# EAGLE schematic atmega2560.2 (EAGLE 8.3.0)

## Sheet 1 of 7
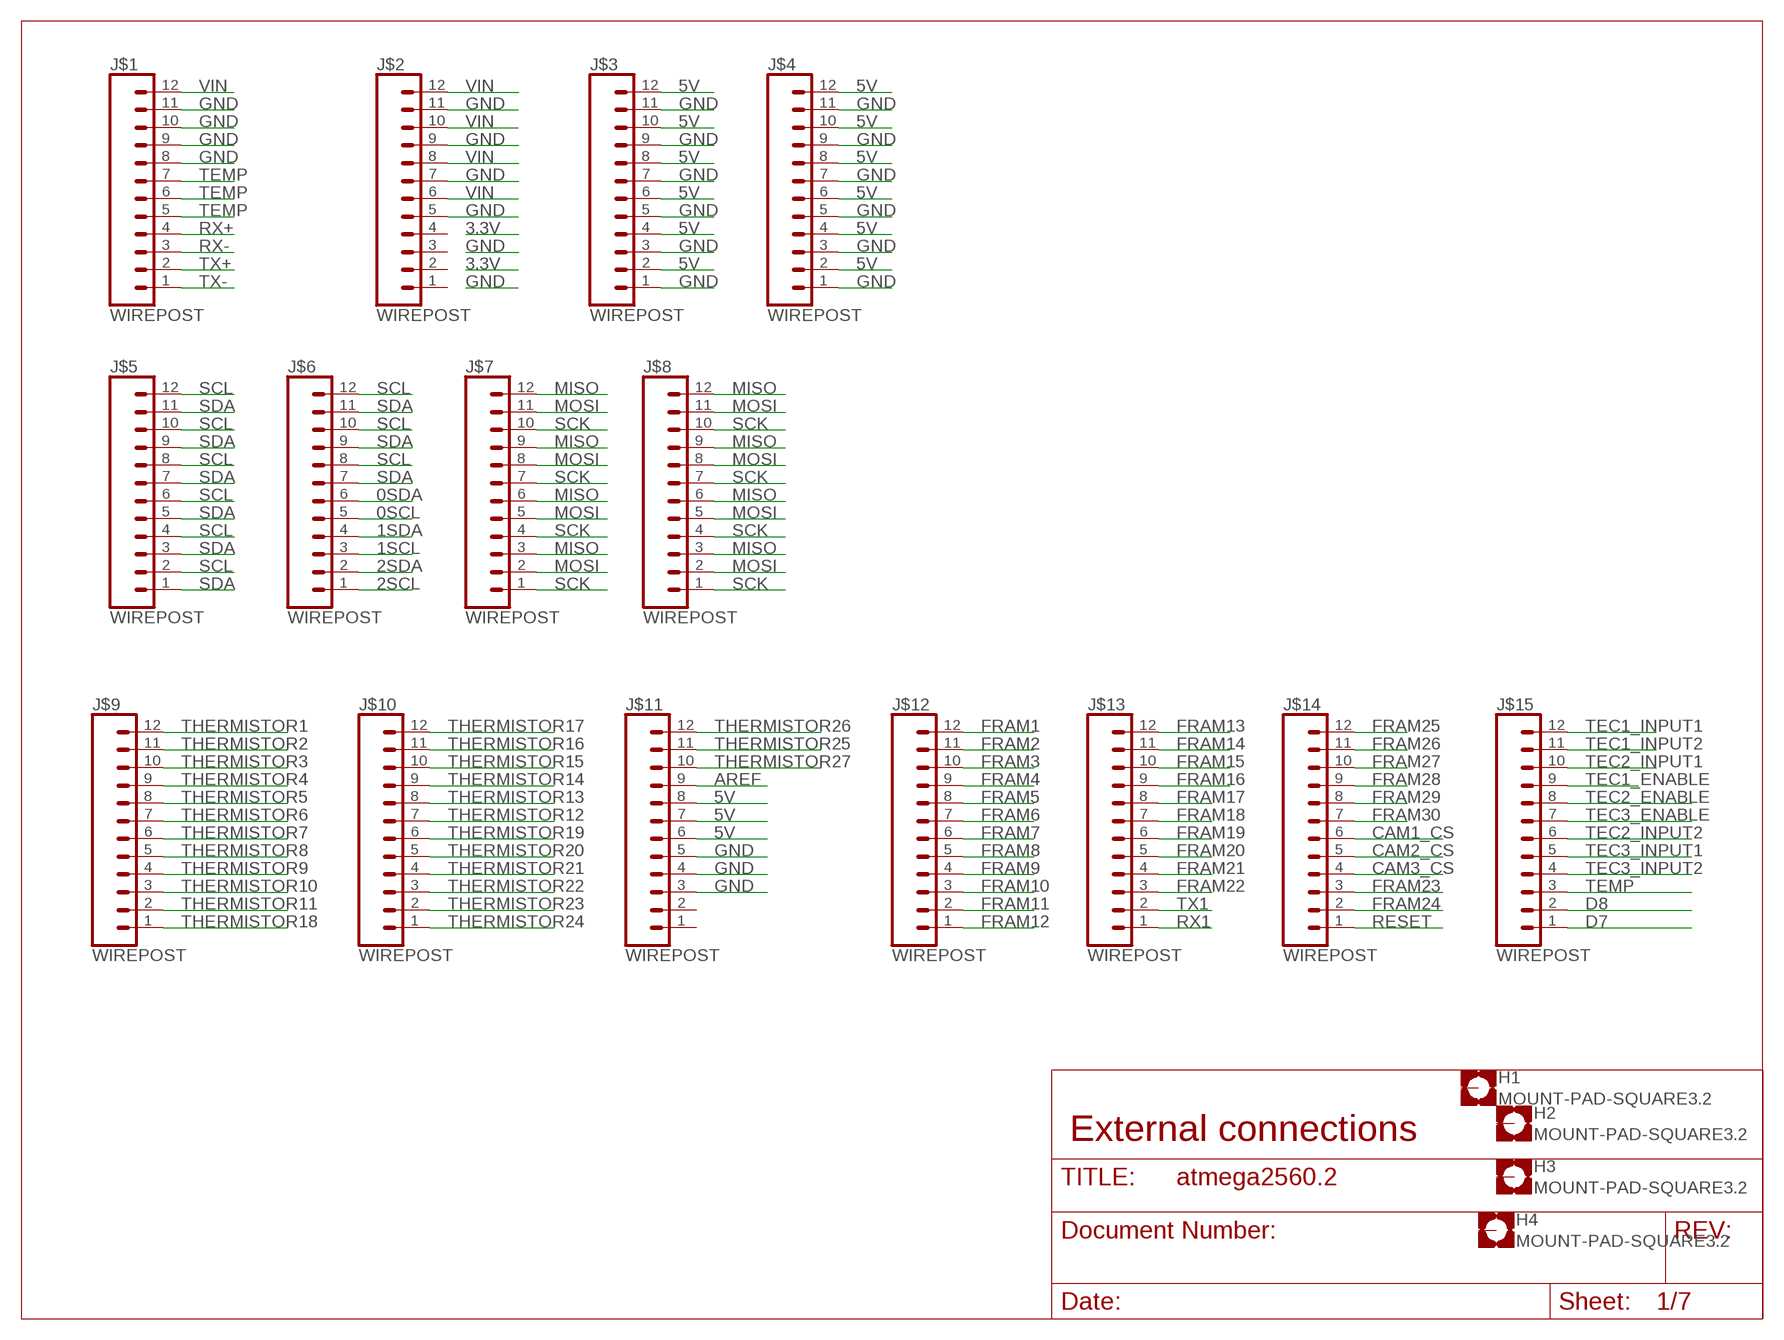
[diagram p0: schematic, sheet 1]

### Parts
H1  MOUNT-PAD-SQUARE3.2  [3,2-PAD-SQUARE]
H2  MOUNT-PAD-SQUARE3.2  [3,2-PAD-SQUARE]
H3  MOUNT-PAD-SQUARE3.2  [3,2-PAD-SQUARE]
H4  MOUNT-PAD-SQUARE3.2  [3,2-PAD-SQUARE]
J$1  WIREPOST  [WIREWRAPPOST]
J$2  WIREPOST  [WIREWRAPPOST]
J$3  WIREPOST  [WIREWRAPPOST]
J$4  WIREPOST  [WIREWRAPPOST]
J$5  WIREPOST  [WIREWRAPPOST]
J$6  WIREPOST  [WIREWRAPPOST]
J$7  WIREPOST  [WIREWRAPPOST]
J$8  WIREPOST  [WIREWRAPPOST]
J$9  WIREPOST  [WIREWRAPPOST]
J$10  WIREPOST  [WIREWRAPPOST]
J$11  WIREPOST  [WIREWRAPPOST]
J$12  WIREPOST  [WIREWRAPPOST]
J$13  WIREPOST  [WIREWRAPPOST]
J$14  WIREPOST  [WIREWRAPPOST]
J$15  WIREPOST  [WIREWRAPPOST]

### Nets
0SCL: J$6.5 ; also sheet 7
0SDA: J$6.6 ; also sheet 7
1SCL: J$6.3 ; also sheet 7
1SDA: J$6.4 ; also sheet 7
2SCL: J$6.1 ; also sheet 7
2SDA: J$6.2 ; also sheet 7
5V: J$3.2 J$3.4 J$3.6 J$3.8 J$3.10 J$3.12 J$4.2 J$4.4 J$4.6 J$4.8 J$4.10 J$4.12 J$11.6 J$11.7 J$11.8 ; also sheet 2,3,4,5,6,7
AREF: J$11.9 ; also sheet 4
CAM1_CS: J$14.6 ; also sheet 4
CAM2_CS: J$14.5 ; also sheet 4
CAM3_CS: J$14.4 ; also sheet 4
D7: J$15.1 ; also sheet 4
D8: J$15.2 ; also sheet 4
FRAM1: J$12.12 ; also sheet 4
FRAM2: J$12.11 ; also sheet 4
FRAM3: J$12.10 ; also sheet 4
FRAM4: J$12.9 ; also sheet 4
FRAM5: J$12.8 ; also sheet 4
FRAM6: J$12.7 ; also sheet 4
FRAM7: J$12.6 ; also sheet 4
FRAM8: J$12.5 ; also sheet 4
FRAM9: J$12.4 ; also sheet 4
FRAM10: J$12.3 ; also sheet 4
FRAM11: J$12.2 ; also sheet 4
FRAM12: J$12.1 ; also sheet 4
FRAM13: J$13.12 ; also sheet 4
FRAM14: J$13.11 ; also sheet 4
FRAM15: J$13.10 ; also sheet 4
FRAM16: J$13.9 ; also sheet 4
FRAM17: J$13.8 ; also sheet 4
FRAM18: J$13.7 ; also sheet 4
FRAM19: J$13.6 ; also sheet 4
FRAM20: J$13.5 ; also sheet 4
FRAM21: J$13.4 ; also sheet 4
FRAM22: J$13.3 ; also sheet 4
FRAM23: J$14.3 ; also sheet 4
FRAM24: J$14.2 ; also sheet 4
FRAM25: J$14.12 ; also sheet 4
FRAM26: J$14.11 ; also sheet 4
FRAM27: J$14.10 ; also sheet 4
FRAM28: J$14.9 ; also sheet 4
FRAM29 [power usb]: J$14.8 ; also sheet 4
FRAM30: J$14.7 ; also sheet 4
GND [gnd]: J$1.8 J$1.9 J$1.10 J$1.11 J$2.5 J$2.7 J$2.9 J$2.11 J$3.1 J$3.3 J$3.5 J$3.7 J$3.9 J$3.11 J$4.1 J$4.3 J$4.5 J$4.7 J$4.9 J$4.11 J$11.3 J$11.4 J$11.5 ; also sheet 2,3,4,5,6,7
MISO: J$7.3 J$7.6 J$7.9 J$7.12 J$8.3 J$8.6 J$8.9 J$8.12 ; also sheet 4
MOSI: J$7.2 J$7.5 J$7.8 J$7.11 J$8.2 J$8.5 J$8.8 J$8.11 ; also sheet 4
RESET: J$14.1 ; also sheet 4,5
RX1: J$13.1 ; also sheet 4
RX+: J$1.4 ; also sheet 3
RX-: J$1.3 ; also sheet 3
SCK: J$7.1 J$7.4 J$7.7 J$7.10 J$8.1 J$8.4 J$8.7 J$8.10 ; also sheet 4
SCL: J$5.2 J$5.4 J$5.6 J$5.8 J$5.10 J$5.12 J$6.8 J$6.10 J$6.12 ; also sheet 4,7
SDA: J$5.1 J$5.3 J$5.5 J$5.7 J$5.9 J$5.11 J$6.7 J$6.9 J$6.11 ; also sheet 4,7
TEC1_ENABLE: J$15.9 ; also sheet 4
TEC1_INPUT1: J$15.12 ; also sheet 4
TEC1_INPUT2: J$15.11 ; also sheet 4
TEC2_ENABLE: J$15.8 ; also sheet 4
TEC2_INPUT1: J$15.10 ; also sheet 4
TEC2_INPUT2: J$15.6 ; also sheet 4
TEC3_ENABLE: J$15.7 ; also sheet 4
TEC3_INPUT1: J$15.5 ; also sheet 4
TEC3_INPUT2: J$15.4 ; also sheet 4
TEMP: J$1.5 J$1.6 J$1.7 J$15.3 ; also sheet 2,4
THERMISTOR1: J$9.12 ; also sheet 4
THERMISTOR2: J$9.11 ; also sheet 4
THERMISTOR3: J$9.10 ; also sheet 4
THERMISTOR4: J$9.9 ; also sheet 4
THERMISTOR5: J$9.8 ; also sheet 4
THERMISTOR6: J$9.7 ; also sheet 4
THERMISTOR7: J$9.6 ; also sheet 4
THERMISTOR8: J$9.5 ; also sheet 4
THERMISTOR9: J$9.4 ; also sheet 4
THERMISTOR10: J$9.3 ; also sheet 4
THERMISTOR11: J$9.2 ; also sheet 4
THERMISTOR12: J$10.7 ; also sheet 6
THERMISTOR13: J$10.8 ; also sheet 6
THERMISTOR14: J$10.9 ; also sheet 6
THERMISTOR15: J$10.10 ; also sheet 6
THERMISTOR16: J$10.11 ; also sheet 6
THERMISTOR17: J$10.12 ; also sheet 6
THERMISTOR18: J$9.1 ; also sheet 6
THERMISTOR19: J$10.6 ; also sheet 6
THERMISTOR20: J$10.5 ; also sheet 6
THERMISTOR21: J$10.4 ; also sheet 6
THERMISTOR22: J$10.3 ; also sheet 6
THERMISTOR23: J$10.2 ; also sheet 6
THERMISTOR24: J$10.1 ; also sheet 6
THERMISTOR25: J$11.11 ; also sheet 6
THERMISTOR26: J$11.12 ; also sheet 6
THERMISTOR27: J$11.10 ; also sheet 6
TX1: J$13.2 ; also sheet 4
TX+: J$1.2 ; also sheet 3
TX- [power]: J$1.1 ; also sheet 3
VIN [power]: J$1.12 J$2.6 J$2.8 J$2.10 J$2.12 ; also sheet 2
Unconnected: H1.B3,2(MOUNT) H2.B3,2(MOUNT) H3.B3,2(MOUNT) H4.B3,2(MOUNT) J$2.1 J$2.2 J$2.3 J$2.4 J$11.1 J$11.2

### Notes on the sheet
- External connections

## Sheet 2 of 7
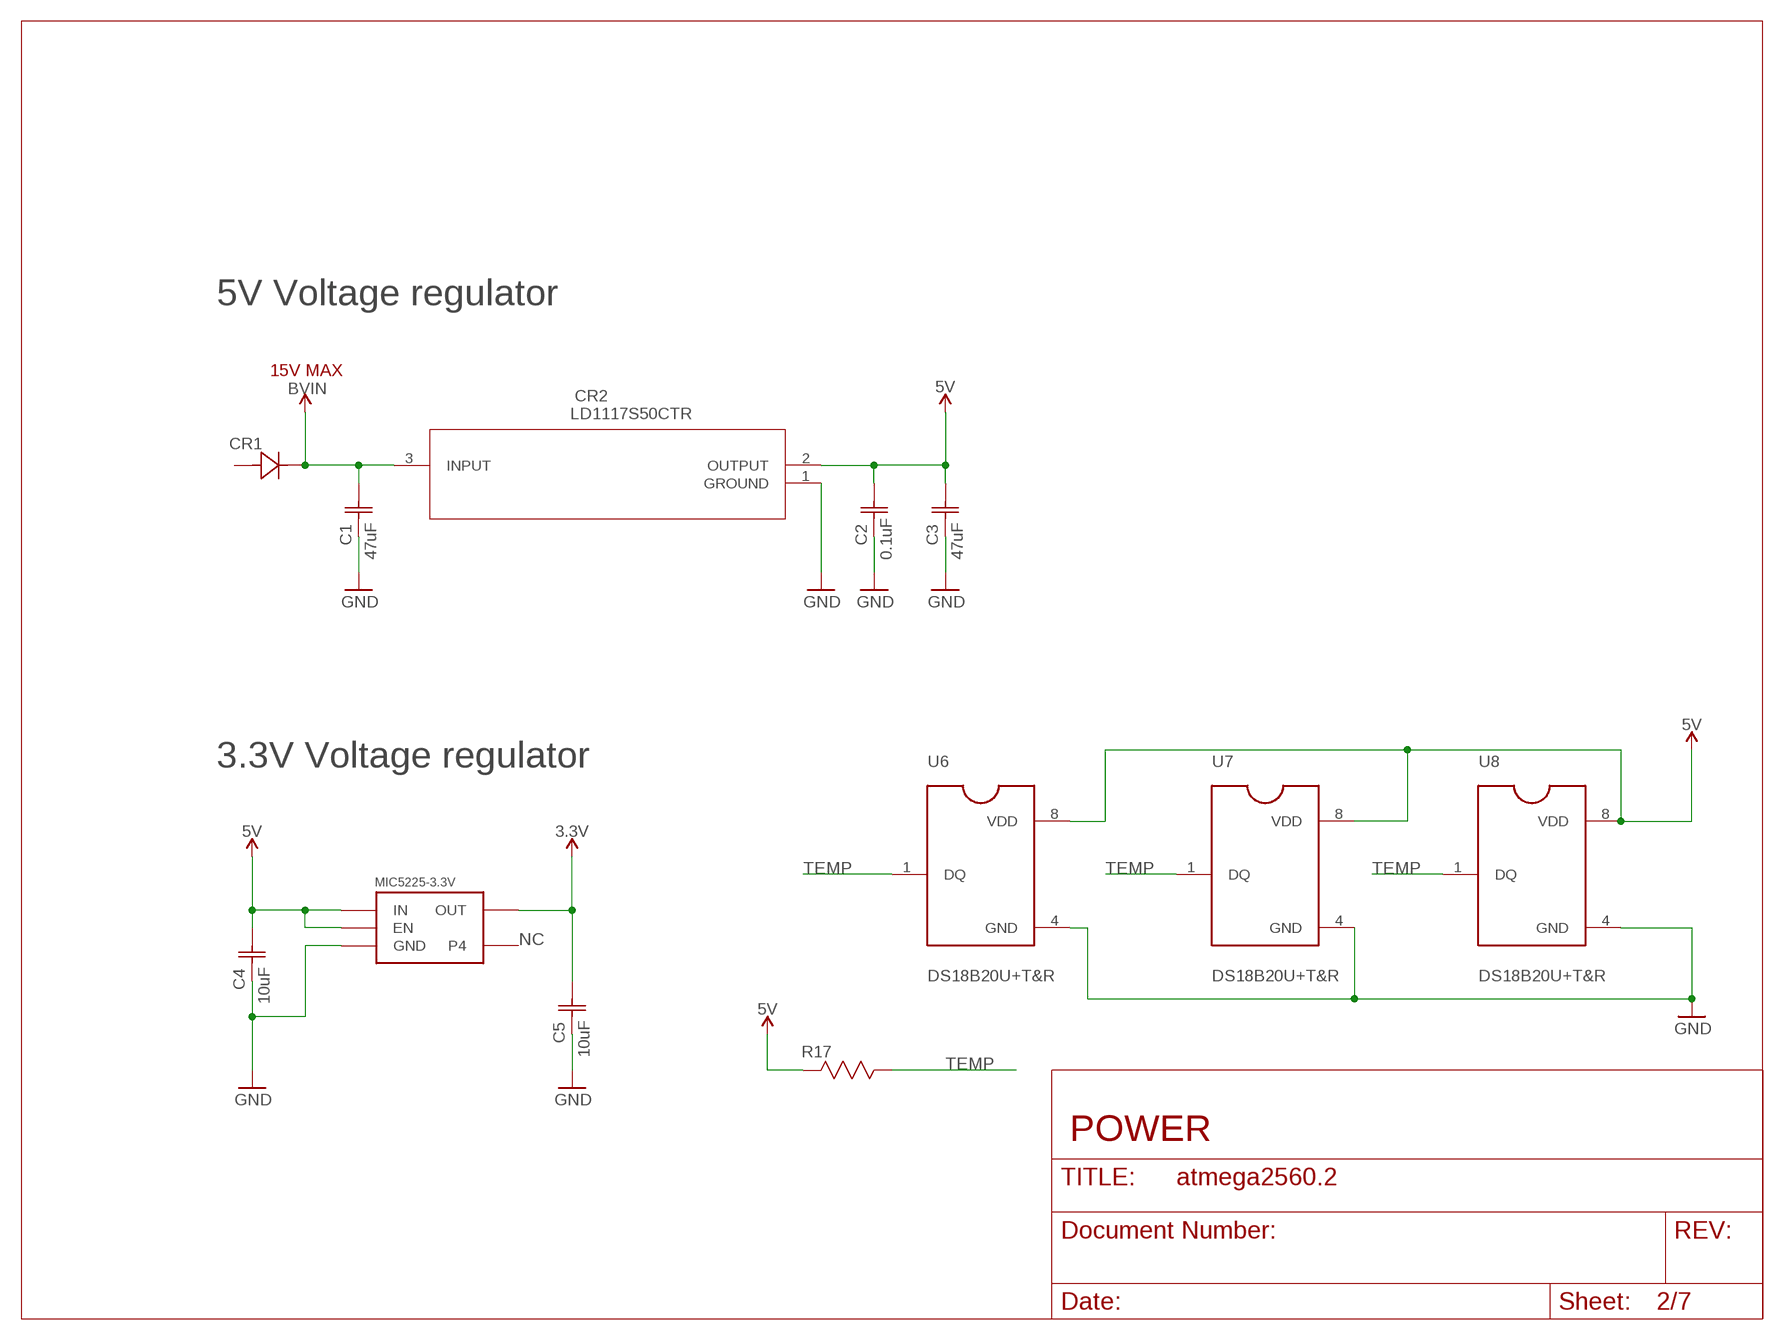
[diagram p1: schematic, sheet 2]

### Parts
C1  47uF  CAP_47UF  [CAP_5750]
C2  0.1uF  CAP_01UF  [CAP_01]
C3  47uF  CAP_47UF  [CAP_5750]
C4  10uF  CAP_10UF  [CAP_GRM219R61A106KE44D]
C5  10uF  CAP_10UF  [CAP_GRM219R61A106KE44D]
CR1  DIODE_600V_3A  [DIODE_600V_3A]
CR2  LD1117S50CTR  [SOT-223]
R17  RES_4_7K  [RC0603N]
U1  MIC5225  [SOT23-5]
U6  DS18B20U+T&R  [SOP65P500X110-8N]
U7  DS18B20U+T&R  [SOP65P500X110-8N]
U8  DS18B20U+T&R  [SOP65P500X110-8N]

### Nets
3.3V: C5.2 U1.OUT ; supply symbol labelled POWER_3.3V ; also sheet 1,3
5V: C2.2 C3.2 C4.2 CR2.2(OUTPUT) R17.2 U1.EN U1.IN U6.8(VDD) U7.8(VDD) U8.8(VDD) ; supply symbol labelled POWER_5V ; also sheet 1,3,4,5,6,7
GND [gnd]: C1.1 C2.1 C3.1 C4.1 C5.1 CR2.1(GROUND) U1.GND U6.4(GND) U7.4(GND) U8.4(GND) ; supply symbol labelled POWER_GND ; also sheet 1,3,4,5,6,7
TEMP: R17.1 U6.1(DQ) U7.1(DQ) U8.1(DQ) ; also sheet 1,4
VIN [power]: C1.2 CR1.1 CR2.3(INPUT) ; supply symbol labelled POWER_VIN ; also sheet 1
Unconnected: CR1.2 U1.NC/ADJ(P4)

### Notes on the sheet
- 5V Voltage regulator
- 15V MAX
- 3.3V Voltage regulator
- NC
- POWER

## Sheet 3 of 7
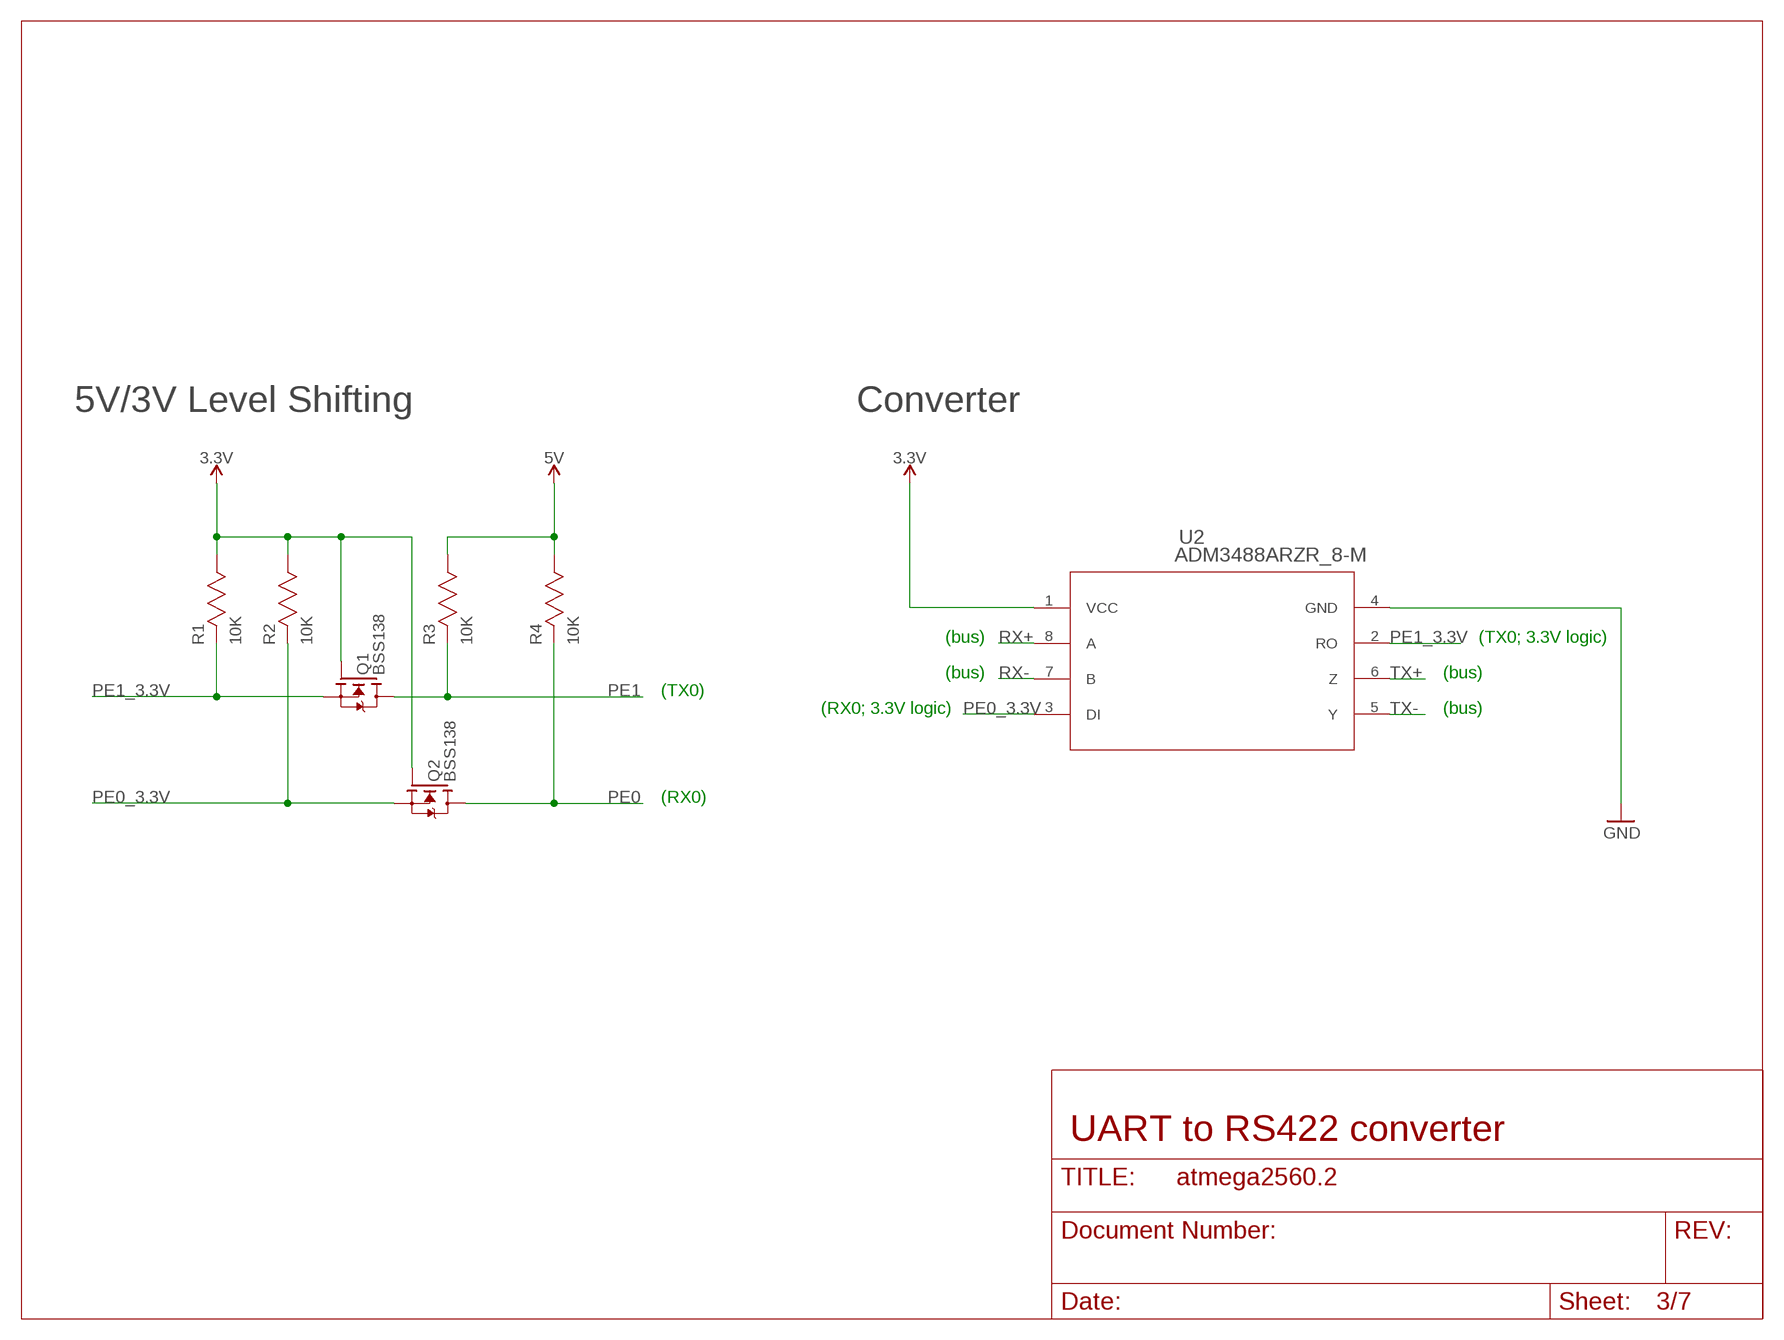
[diagram p2: schematic, sheet 3]

### Parts
Q1  BSS138  [SOT-23]
Q2  BSS138  [SOT-23]
R1  10K  RES_10K  [RC0603N]
R2  10K  RES_10K  [RC0603N]
R3  10K  RES_10K  [RC0603N]
R4  10K  RES_10K  [RC0603N]
U2  ADM3488ARZR_8-M  [R_8-M]

### Nets
3.3V: Q1.G Q2.G R1.1 R2.1 U2.1(VCC) ; supply symbol labelled POWER_3.3V ; also sheet 1,2
5V: R3.1 R4.1 ; supply symbol labelled POWER_5V ; also sheet 1,2,4,5,6,7
GND [gnd]: U2.4(GND) ; supply symbol labelled POWER_GND ; also sheet 1,2,4,5,6,7
PE0: Q2.D R4.2 ; also sheet 4,5
PE0_3.3V: Q2.S R2.2 U2.3(DI)
PE1: Q1.D R3.2 ; also sheet 4,5
PE1_3.3V: Q1.S R1.2 U2.2(RO)
RX+: U2.8(A) ; also sheet 1
RX-: U2.7(B) ; also sheet 1
TX+: U2.6(Z) ; also sheet 1
TX- [power]: U2.5(Y) ; also sheet 1

### Notes on the sheet
- 5V/3V Level Shifting | Converter
- (bus) | (TX0; 3.3V logic)
- (bus) | (bus)
- (TX0)
- (RX0; 3.3V logic) | (bus)
- (RX0)
- UART to RS422 converter

## Sheet 4 of 7
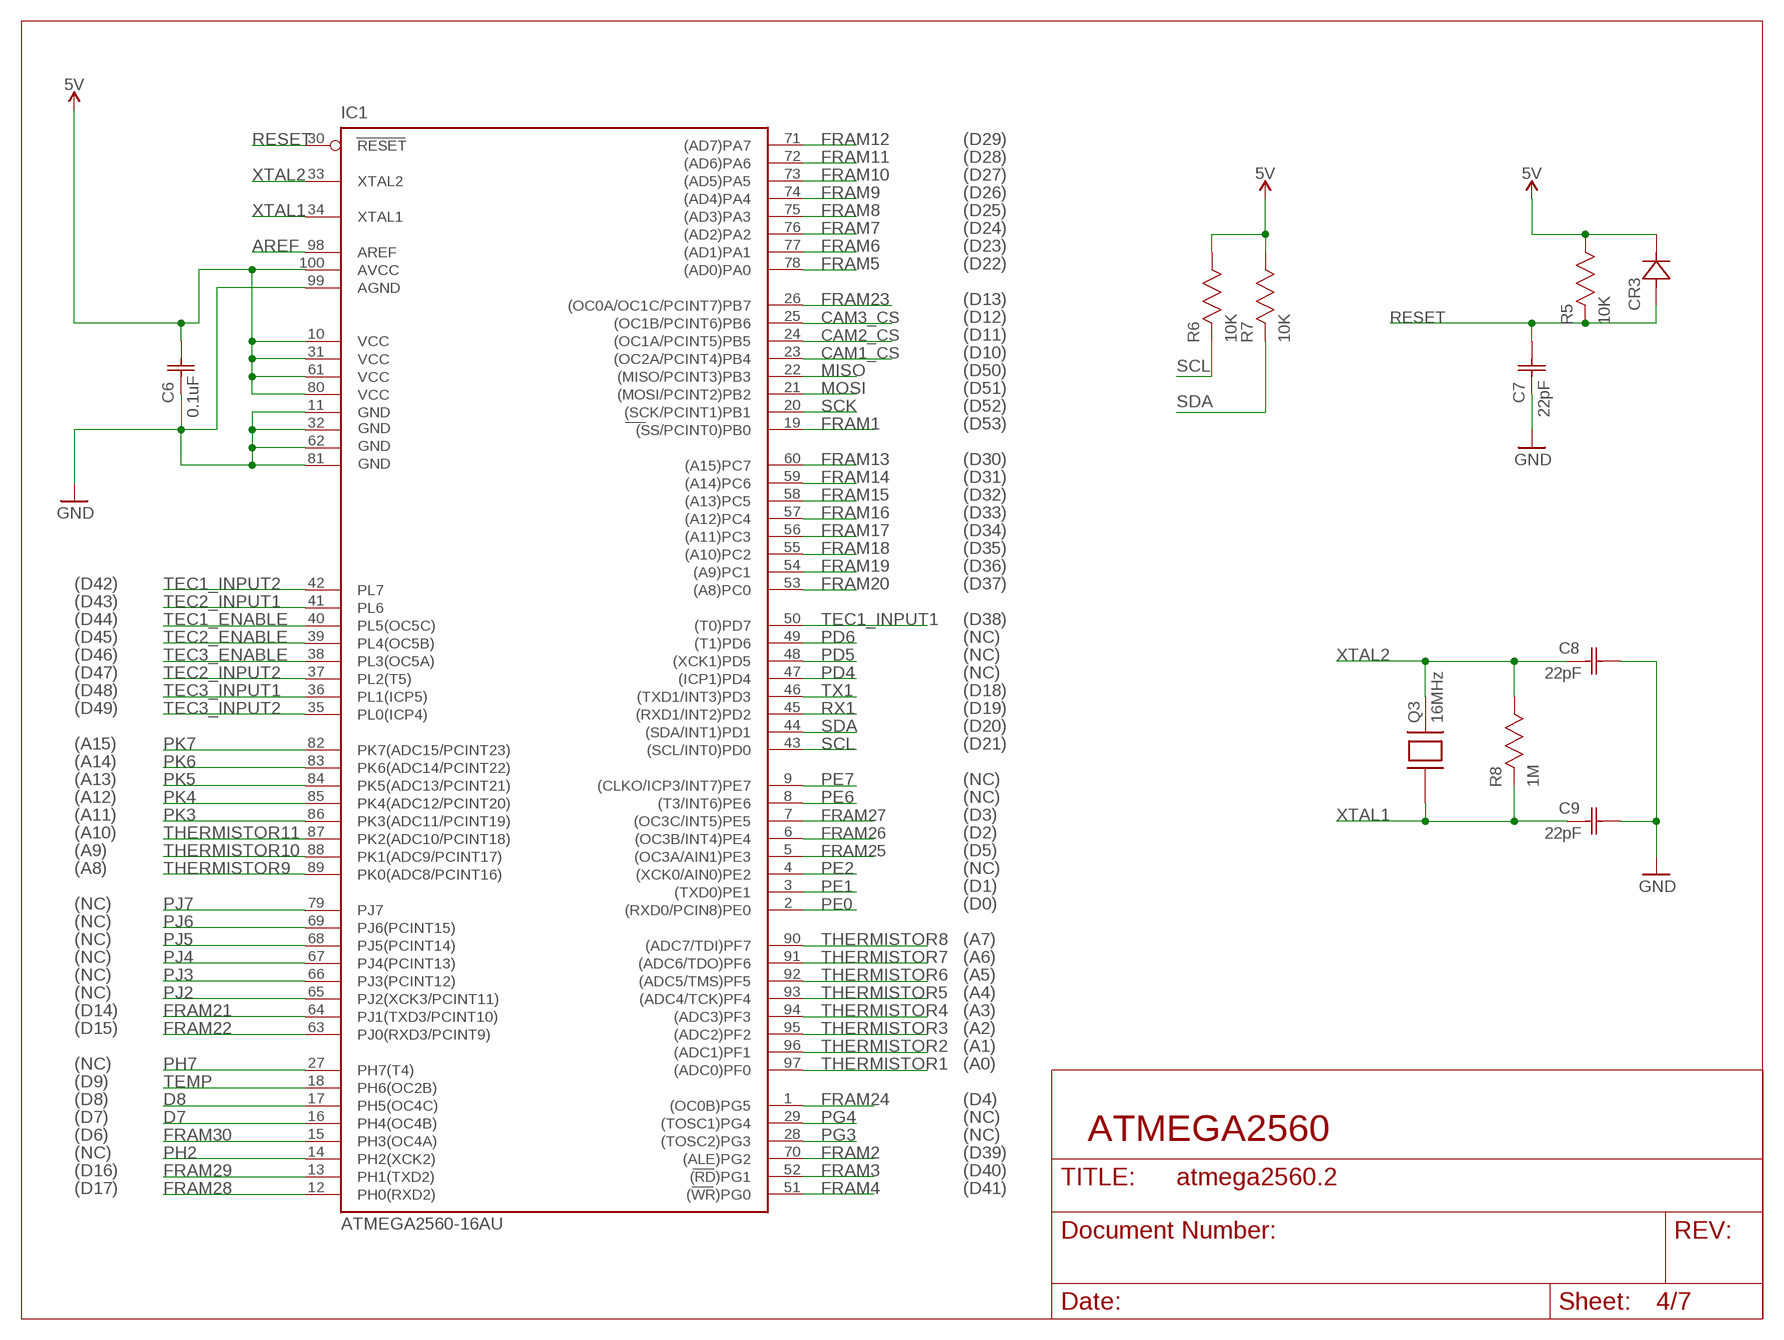
[diagram p3: schematic, sheet 4]

### Parts
C6  0.1uF  CAP_01UF  [CAP_01]
C7  22pF  CAP_22PF  [CC0805N]
C8  22pF  CAP_22PF  [CC0805N]
C9  22pF  CAP_22PF  [CC0805N]
CR3  DIODE_600V_3A  [DIODE_600V_3A]
IC1  ATMEGA2560-16AU  ATMEGA25602560-16AU  [TQFP100]
Q3  16MHz  OSILLATOR  [OSCILLATOR]
R5  10K  RES_10K  [RC0603N]
R6  10K  RES_10K  [RC0603N]
R7  10K  RES_10K  [RC0603N]
R8  1M  RES_1M  [RC0603N]

### Nets
5V: C6.2 CR3.1 IC1.10(VCC) IC1.31(VCC1) IC1.61(VCC2) IC1.80(VCC3) IC1.100(AVCC) R5.1 R6.1 R7.1 ; supply symbol labelled POWER_5V ; also sheet 1,2,3,5,6,7
AREF: IC1.98(AREF) ; also sheet 1
CAM1_CS: IC1.23((OC2A/PCINT4)PB4) ; also sheet 1
CAM2_CS: IC1.24((OC1A/PCINT5)PB5) ; also sheet 1
CAM3_CS: IC1.25((OC1B/PCINT6)PB6) ; also sheet 1
D7: IC1.16(PH4(OC4B)) ; also sheet 1
D8: IC1.17(PH5(OC4C)) ; also sheet 1
FRAM1: IC1.19((SS/PCINT0)PB0) ; also sheet 1
FRAM2: IC1.70((ALE)PG2) ; also sheet 1
FRAM3: IC1.52((RD)PG1) ; also sheet 1
FRAM4: IC1.51((WR)PG0) ; also sheet 1
FRAM5: IC1.78((AD0)PA0) ; also sheet 1
FRAM6: IC1.77((AD1)PA1) ; also sheet 1
FRAM7: IC1.76((AD2)PA2) ; also sheet 1
FRAM8: IC1.75((AD3)PA3) ; also sheet 1
FRAM9: IC1.74((AD4)PA4) ; also sheet 1
FRAM10: IC1.73((AD5)PA5) ; also sheet 1
FRAM11: IC1.72((AD6)PA6) ; also sheet 1
FRAM12: IC1.71((AD7)PA7) ; also sheet 1
FRAM13: IC1.60((A15)PC7) ; also sheet 1
FRAM14: IC1.59((A14)PC6) ; also sheet 1
FRAM15: IC1.58((A13)PC5) ; also sheet 1
FRAM16: IC1.57((A12)PC4) ; also sheet 1
FRAM17: IC1.56((A11)PC3) ; also sheet 1
FRAM18: IC1.55((A10)PC2) ; also sheet 1
FRAM19: IC1.54((A9)PC1) ; also sheet 1
FRAM20: IC1.53((A8)PC0) ; also sheet 1
FRAM21: IC1.64(PJ1(TXD3/PCINT10)) ; also sheet 1
FRAM22: IC1.63(PJ0(RXD3/PCINT9)) ; also sheet 1
FRAM23: IC1.26((OC0A/OC1C/PCINT7)PB7) ; also sheet 1
FRAM24: IC1.1((OC0B)PG5) ; also sheet 1
FRAM25: IC1.5((OC3A/AIN1)PE3) ; also sheet 1
FRAM26: IC1.6((OC3B/INT4)PE4) ; also sheet 1
FRAM27: IC1.7((OC3C/INT5)PE5) ; also sheet 1
FRAM28: IC1.12(PH0(RXD2)) ; also sheet 1
FRAM29 [power usb]: IC1.13(PH1(TXD2)) ; also sheet 1
FRAM30: IC1.15(PH3(OC4A)) ; also sheet 1
GND [gnd]: C6.1 C7.1 C8.2 C9.2 IC1.11(GND) IC1.32(GND1) IC1.62(GND2) IC1.81(GND3) IC1.99(AGND) ; supply symbol labelled POWER_GND ; also sheet 1,2,3,5,6,7
MISO: IC1.22((MISO/PCINT3)PB3) ; also sheet 1
MOSI: IC1.21((MOSI/PCINT2)PB2) ; also sheet 1
PD4: IC1.47((ICP1)PD4)
PD5: IC1.48((XCK1)PD5)
PD6: IC1.49((T1)PD6)
PE0: IC1.2((RXD0/PCIN8)PE0) ; also sheet 3,5
PE1: IC1.3((TXD0)PE1) ; also sheet 3,5
PE2: IC1.4((XCK0/AIN0)PE2)
PE6: IC1.8((T3/INT6)PE6)
PE7: IC1.9((CLKO/ICP3/INT7)PE7)
PG3: IC1.28((TOSC2)PG3)
PG4: IC1.29((TOSC1)PG4)
PH2: IC1.14(PH2(XCK2))
PH7: IC1.27(PH7(T4))
PJ2: IC1.65(PJ2(XCK3/PCINT11))
PJ3: IC1.66(PJ3(PCINT12))
PJ4: IC1.67(PJ4(PCINT13))
PJ5: IC1.68(PJ5(PCINT14))
PJ6: IC1.69(PJ6(PCINT15))
PJ7: IC1.79(PJ7)
PK3: IC1.86(PK3(ADC11/PCINT19)) ; also sheet 6
PK4: IC1.85(PK4(ADC12/PCINT20)) ; also sheet 6
PK5: IC1.84(PK5(ADC13/PCINT21)) ; also sheet 6
PK6: IC1.83(PK6(ADC14/PCINT22)) ; also sheet 6
PK7: IC1.82(PK7(ADC15/PCINT23)) ; also sheet 6
RESET: C7.2 CR3.2 IC1.30(RESET) R5.2 ; also sheet 1,5
RX1: IC1.45((RXD1/INT2)PD2) ; also sheet 1
SCK: IC1.20((SCK/PCINT1)PB1) ; also sheet 1
SCL: IC1.43((SCL/INT0)PD0) R6.2 ; also sheet 1,7
SDA: IC1.44((SDA/INT1)PD1) R7.2 ; also sheet 1,7
TEC1_ENABLE: IC1.40(PL5(OC5C)) ; also sheet 1
TEC1_INPUT1: IC1.50((T0)PD7) ; also sheet 1
TEC1_INPUT2: IC1.42(PL7) ; also sheet 1
TEC2_ENABLE: IC1.39(PL4(OC5B)) ; also sheet 1
TEC2_INPUT1: IC1.41(PL6) ; also sheet 1
TEC2_INPUT2: IC1.37(PL2(T5)) ; also sheet 1
TEC3_ENABLE: IC1.38(PL3(OC5A)) ; also sheet 1
TEC3_INPUT1: IC1.36(PL1(ICP5)) ; also sheet 1
TEC3_INPUT2: IC1.35(PL0(ICP4)) ; also sheet 1
TEMP: IC1.18(PH6(OC2B)) ; also sheet 1,2
THERMISTOR1: IC1.97((ADC0)PF0) ; also sheet 1
THERMISTOR2: IC1.96((ADC1)PF1) ; also sheet 1
THERMISTOR3: IC1.95((ADC2)PF2) ; also sheet 1
THERMISTOR4: IC1.94((ADC3)PF3) ; also sheet 1
THERMISTOR5: IC1.93((ADC4/TCK)PF4) ; also sheet 1
THERMISTOR6: IC1.92((ADC5/TMS)PF5) ; also sheet 1
THERMISTOR7: IC1.91((ADC6/TDO)PF6) ; also sheet 1
THERMISTOR8: IC1.90((ADC7/TDI)PF7) ; also sheet 1
THERMISTOR9: IC1.89(PK0(ADC8/PCINT16)) ; also sheet 1
THERMISTOR10: IC1.88(PK1(ADC9/PCINT17)) ; also sheet 1
THERMISTOR11: IC1.87(PK2(ADC10/PCINT18)) ; also sheet 1
TX1: IC1.46((TXD1/INT3)PD3) ; also sheet 1
XTAL1: C9.1 IC1.34(XTAL1) Q3.1 R8.2
XTAL2: C8.1 IC1.33(XTAL2) Q3.2 R8.1

### Notes on the sheet
- (D29)
- (D28)
- (D27)
- (D26)
- (D25)
- (D24)
- (D23)
- (D22)
- (D13)
- (D12)
- (D11)
- (D10)
- (D50)
- (D51)
- (D52)
- (D53)
- (D30)
- (D31)
- (D32)
- (D33)
- (D34)
- (D35)
- (D36)
- (D42) | (D37)
- (D43)
- (D44) | (D38)
- (D45) | (NC)
- (D46) | (NC)
- (D47) | (NC)
- (D48) | (D18)
- (D49) | (D19)
- (D20)
- (A15) | (D21)
- (A14)
- (A13) | (NC)
- (A12) | (NC)
- (A11) | (D3)
- (A10) | (D2)
- (A9) | (D5)
- (A8) | (NC)
- (D1)
- (NC) | (D0)
- (NC)
- (NC) | (A7)
- (NC) | (A6)
- (NC) | (A5)
- (NC) | (A4)
- (D14) | (A3)
- (D15) | (A2)
- (A1)
- (NC) | (A0)
- (D9)
- (D8) | (D4)
- (D7) | (NC)
- (D6) | (NC) | ATMEGA2560
- (NC) | (D39)
- (D16) | (D40)
- (D17) | (D41)

## Sheet 5 of 7
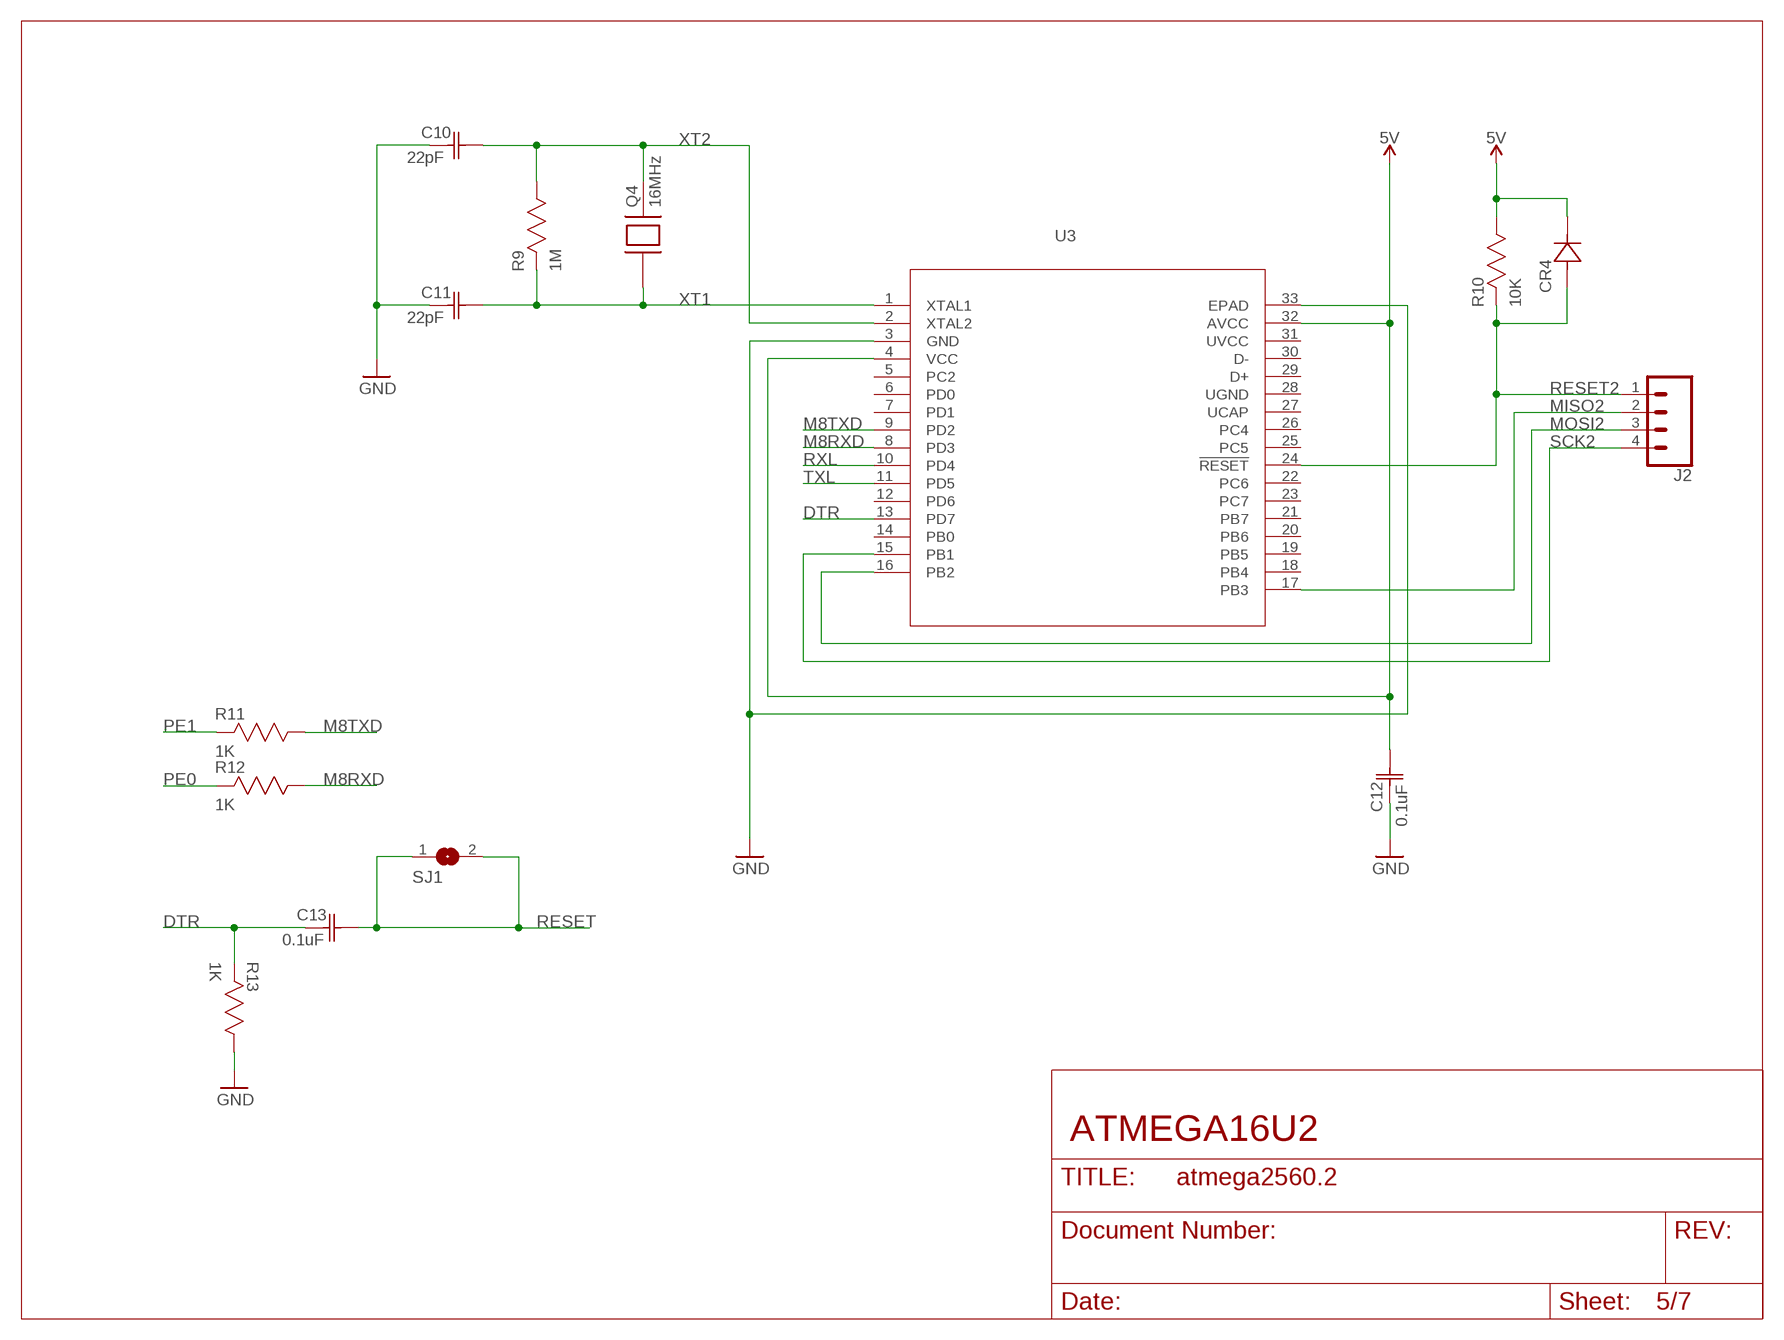
[diagram p4: schematic, sheet 5]

### Parts
C10  22pF  CAP_22PF  [CC0805N]
C11  22pF  CAP_22PF  [CC0805N]
C12  0.1uF  CAP_01UF  [CAP_01]
C13  0.1uF  CAP_01UF  [CAP_01]
CR4  DIODE_600V_3A  [DIODE_600V_3A]
J2  CONN_04  [1X04]
Q4  16MHz  OSILLATOR  [OSCILLATOR]
R9  1M  RES_1M  [RC0603N]
R10  10K  RES_10K  [RC0603N]
R11  1K  RES_1K  [RC0603N]
R12  1K  RES_1K  [RC0603N]
R13  1K  RES_1K  [RC0603N]
SJ1  SJ  [SJ]
U3  ATMEGA16U2-MU  [32M1-A]

### Nets
5V: C12.2 CR4.1 R10.1 U3.4(VCC) U3.32(AVCC) ; supply symbol labelled POWER_5V ; also sheet 1,2,3,4,6,7
DTR: C13.1 R13.2 U3.13(PD7)
GND [gnd]: C10.1 C11.1 C12.1 R13.1 U3.3(GND) U3.33(EPAD) ; supply symbol labelled POWER_GND ; also sheet 1,2,3,4,6,7
M8RXD: R12.1 U3.8(PD3)
M8TXD: R11.1 U3.9(PD2)
MISO2: J2.2 U3.17(PB3)
MOSI2: J2.3 U3.16(PB2)
PE0: R12.2 ; also sheet 3,4
PE1: R11.2 ; also sheet 3,4
RESET: C13.2 SJ1.1 SJ1.2 ; also sheet 1,4
RESET2: CR4.2 J2.1 R10.2 U3.24(!RESET)
RXL: U3.10(PD4)
SCK2: J2.4 U3.15(PB1)
TXL: U3.11(PD5)
XT1: C11.2 Q4.1 R9.2 U3.1(XTAL1)
XT2: C10.2 Q4.2 R9.1 U3.2(XTAL2)
Unconnected: U3.5(PC2) U3.6(PD0) U3.7(PD1) U3.12(PD6) U3.14(PB0) U3.18(PB4) U3.19(PB5) U3.20(PB6) U3.21(PB7) U3.22(PC6) U3.23(PC7) U3.25(PC5) U3.26(PC4) U3.27(UCAP) U3.29(D+) U3.30(D-)

### Notes on the sheet
- ATMEGA16U2

## Sheet 6 of 7
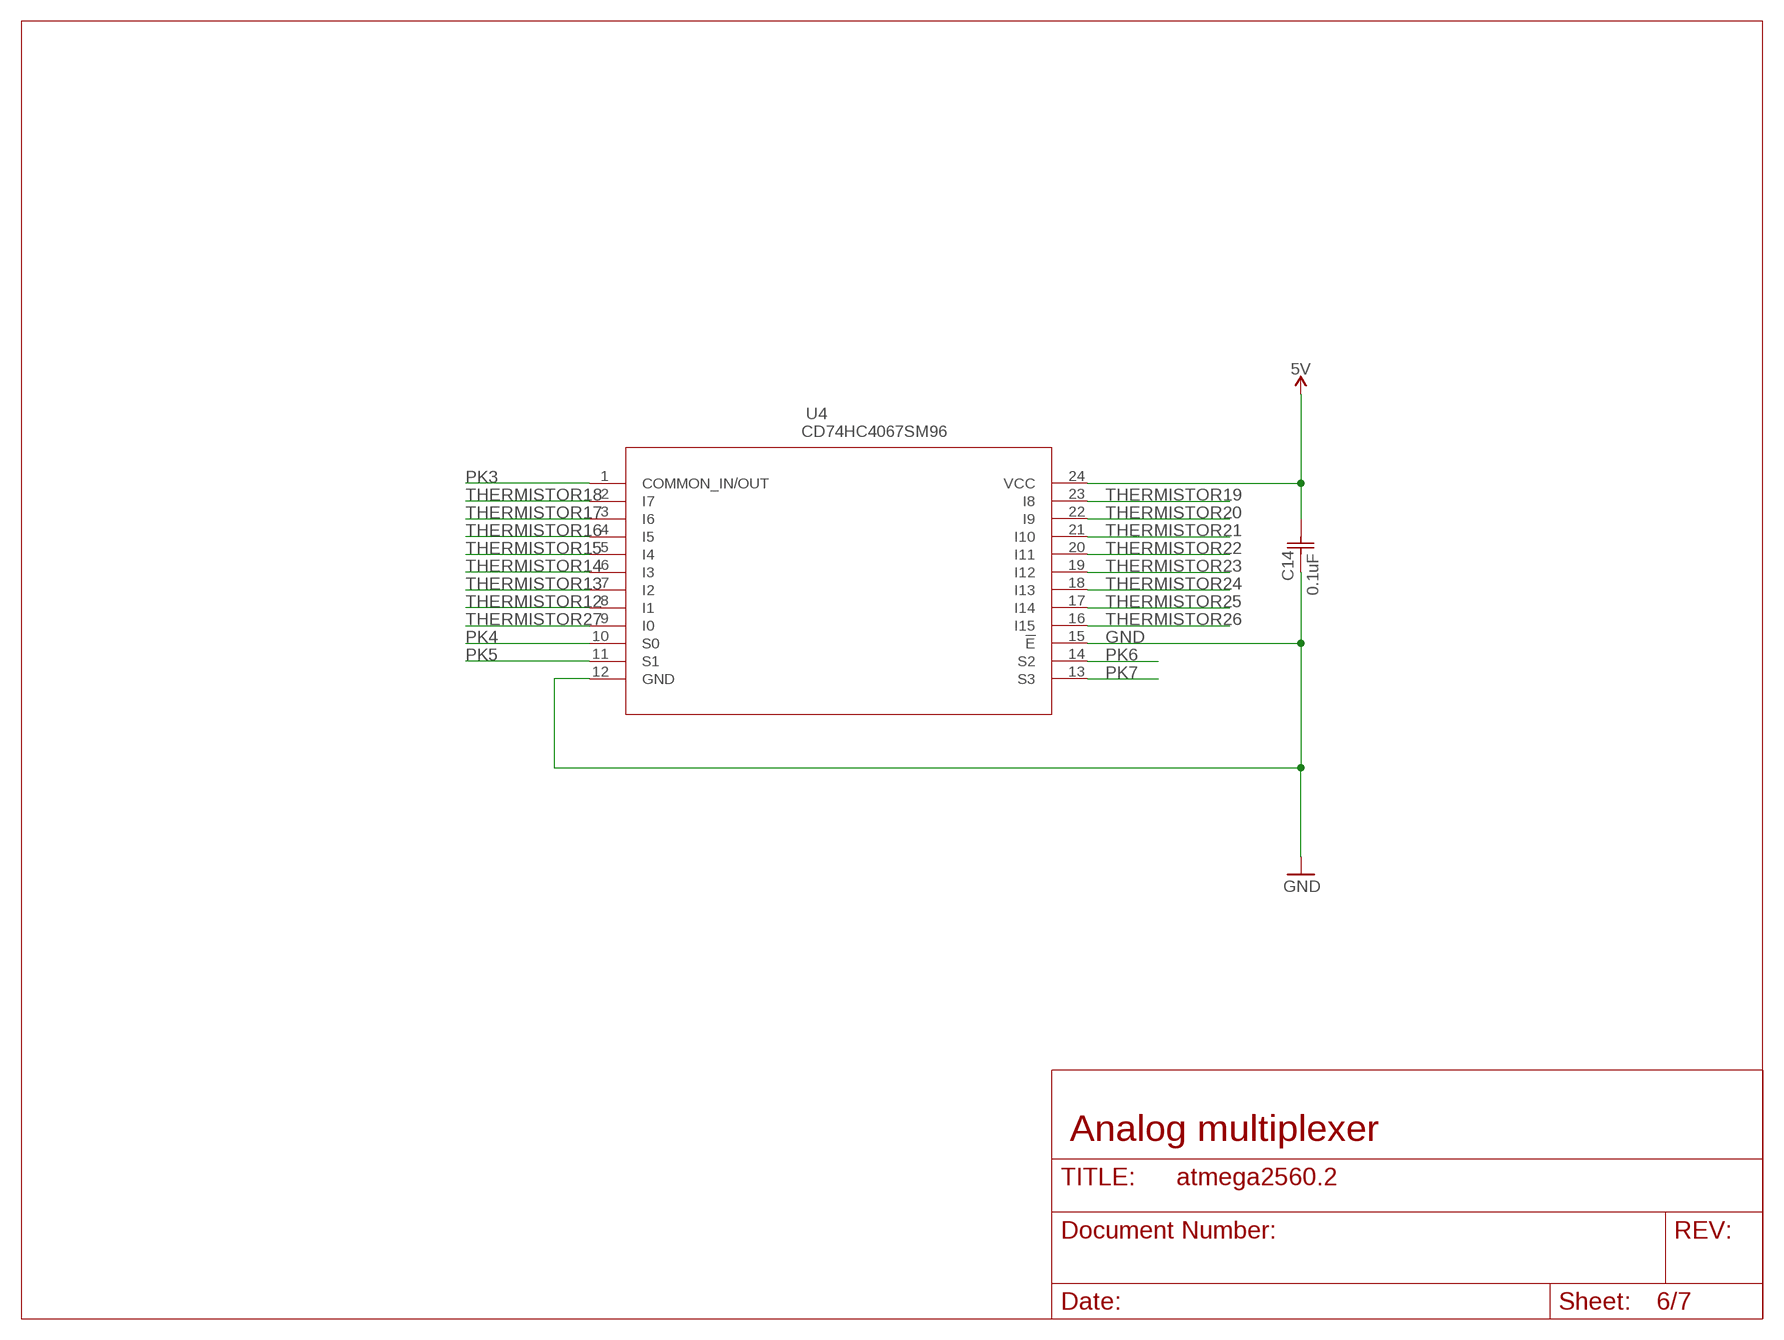
[diagram p5: schematic, sheet 6]

### Parts
C14  0.1uF  CAP_01UF  [CAP_01]
U4  CD74HC4067SM96  [DB24]

### Nets
5V: C14.2 U4.24(VCC) ; supply symbol labelled POWER_5V ; also sheet 1,2,3,4,5,7
GND [gnd]: C14.1 U4.12(GND) U4.15(!E) ; supply symbol labelled POWER_GND ; also sheet 1,2,3,4,5,7
PK3: U4.1(COMMON_IN/OUT) ; also sheet 4
PK4: U4.10(S0) ; also sheet 4
PK5: U4.11(S1) ; also sheet 4
PK6: U4.14(S2) ; also sheet 4
PK7: U4.13(S3) ; also sheet 4
THERMISTOR12: U4.8(I1) ; also sheet 1
THERMISTOR13: U4.7(I2) ; also sheet 1
THERMISTOR14: U4.6(I3) ; also sheet 1
THERMISTOR15: U4.5(I4) ; also sheet 1
THERMISTOR16: U4.4(I5) ; also sheet 1
THERMISTOR17: U4.3(I6) ; also sheet 1
THERMISTOR18: U4.2(I7) ; also sheet 1
THERMISTOR19: U4.23(I8) ; also sheet 1
THERMISTOR20: U4.22(I9) ; also sheet 1
THERMISTOR21: U4.21(I10) ; also sheet 1
THERMISTOR22: U4.20(I11) ; also sheet 1
THERMISTOR23: U4.19(I12) ; also sheet 1
THERMISTOR24: U4.18(I13) ; also sheet 1
THERMISTOR25: U4.17(I14) ; also sheet 1
THERMISTOR26: U4.16(I15) ; also sheet 1
THERMISTOR27: U4.9(I0) ; also sheet 1

### Notes on the sheet
- Analog multiplexer

## Sheet 7 of 7
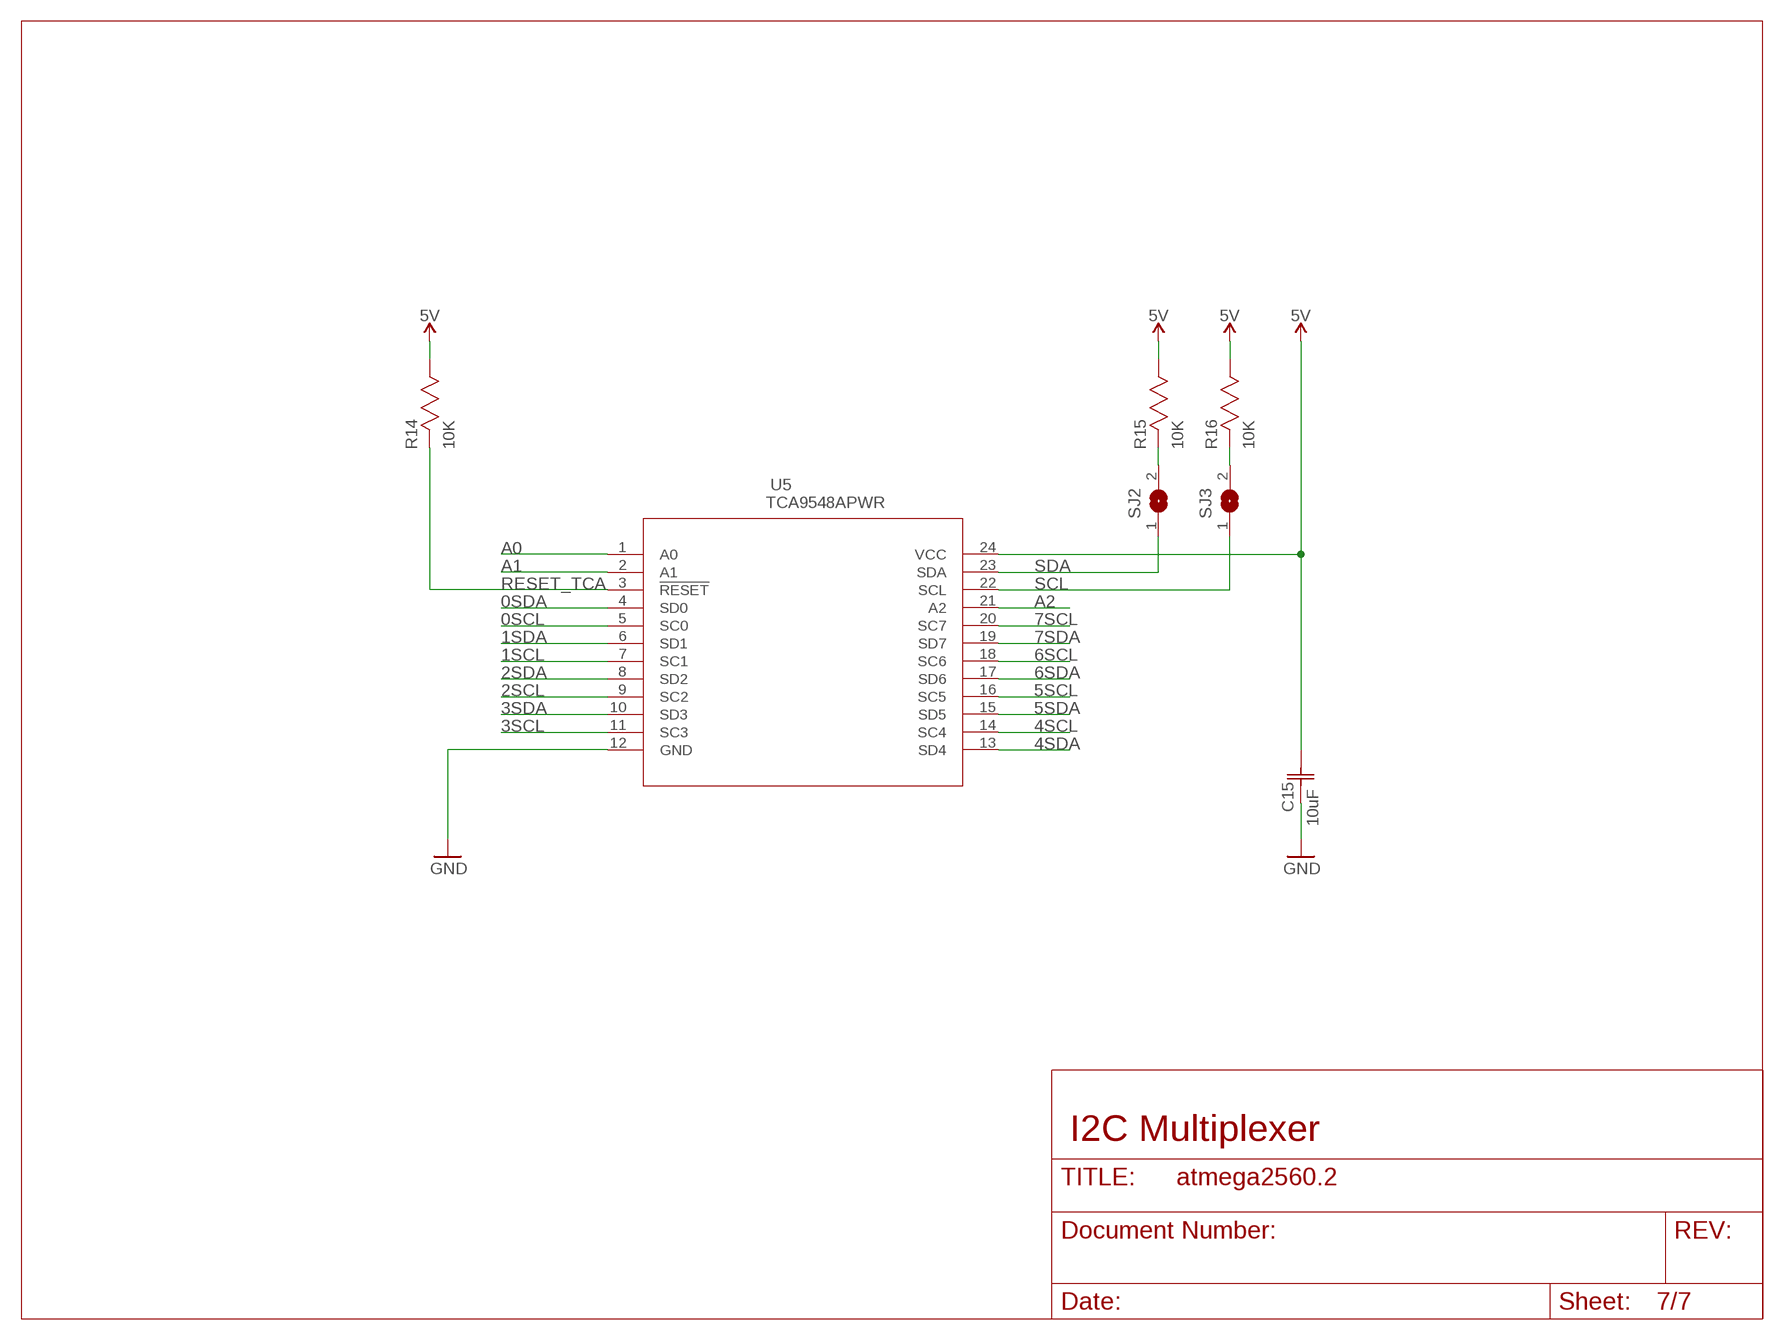
[diagram p6: schematic, sheet 7]

### Parts
C15  10uF  CAP_10UF  [CAP_GRM219R61A106KE44D]
R14  10K  RES_10K  [RC0603N]
R15  10K  RES_10K  [RC0603N]
R16  10K  RES_10K  [RC0603N]
SJ2  SOLDERJUMPERCLOSED  [SOLDERJUMPER_CLOSEDWIRE]
SJ3  SOLDERJUMPERCLOSED  [SOLDERJUMPER_CLOSEDWIRE]
U5  TCA9548APWR  [PW24]

### Nets
0SCL: U5.5(SC0) ; also sheet 1
0SDA: U5.4(SD0) ; also sheet 1
1SCL: U5.7(SC1) ; also sheet 1
1SDA: U5.6(SD1) ; also sheet 1
2SCL: U5.9(SC2) ; also sheet 1
2SDA: U5.8(SD2) ; also sheet 1
3SCL: U5.11(SC3)
3SDA: U5.10(SD3)
4SCL: U5.14(SC4)
4SDA: U5.13(SD4)
5SCL: U5.16(SC5)
5SDA: U5.15(SD5)
5V: C15.2 R14.1 R15.1 R16.1 U5.24(VCC) ; supply symbol labelled POWER_5V ; also sheet 1,2,3,4,5,6
6SCL: U5.18(SC6)
6SDA: U5.17(SD6)
7SCL: U5.20(SC7)
7SDA: U5.19(SD7)
A0: U5.1(A0)
A1: U5.2(A1)
A2: U5.21(A2)
GND [gnd]: C15.1 U5.12(GND) ; supply symbol labelled POWER_GND ; also sheet 1,2,3,4,5,6
N$7: R15.2 SJ2.2
N$8: R16.2 SJ3.2
RESET_TCA: R14.2 U5.3(!RESET)
SCL: SJ3.1 U5.22(SCL) ; also sheet 1,4
SDA: SJ2.1 U5.23(SDA) ; also sheet 1,4

### Notes on the sheet
- I2C Multiplexer

## Power pins joined to a net without a drawn wire
UGND: U3.28(UGND)
UVCC: U3.31(UVCC)

## Library data of the parts
C1 C3 = cubesat_:CAP_47UF: CGA9N3X7R1C476M230KB Digikey 445-7935-1-ND; MANUFACTURER_PART_NUMBER: CGA9N3X7R1C476M230KB; VENDOR: TDK
C2 C6 C12-C14 = cubesat_:CAP_01UF: Digikey 311-1336-1-ND; MANUFACTURER_PART_NUMBER: CC0402KRX5R6BB104; VENDOR: Yageo
C4 C5 C15 = cubesat_:CAP_10UF: GRM219R61A106KE44D Digikey 490-4735-1-ND
C7-C11 = cubesat_:CAP_22PF: Digikey 399-1113-1-ND
CR1 CR3 CR4 = cubesat_:DIODE_600V_3A: Digikey RS3JB-FDICT-ND; MANUFACTURER_PART_NUMBER: RS3JB13F; VENDOR: Diodes Inc
CR2 = cubesat_:LD1117S50CTR: Digikey 497-1243-1-ND; MANUFACTURER_PART_NUMBER: LD1117S50CTR; VENDOR: STMicroelectronics
H1-H4 = holes:MOUNT-PAD-SQUARE: MOUNTING PAD, square
IC1 = SmartPrj:ATMEGA2560: MICROCONTROLLER 64/128/256 Kbytes FLASH 4 Kbytes EEPROM 8 Kbytes SRAM 86 General Purpose I/O pins 12-channels16-bit PWM 4 x Serial USARTs 16-channels 10-bit A/D
J2 = SparkFun-Connectors:CONN_04: Multi connection point. Often used as Generic Header-pin footprint for 0.1 inch spaced/style header connections On any of the 0.1 inch spaced packages, you can populate with these: Break Away Headers - Straight <https://www.sparkfun.com/products/116> (PRT-00116) Break Away Male Headers - Right Angle <https://www.sparkfun.com/products/553> (PRT-00553) Female Headers <https://www.sparkfun.com/products/115> (PRT-00115) Break Away Headers - Machine Pin <https://www.sparkfun.com/products/117> (PRT-00117) Break Away Female Headers - Swiss Machine Pin <https://www.sparkfun.com/products/743> (PRT-00743) For SCREWTERMINALS and SPRING TERMINALS visit here: Screw Terimnals on SparkFun.com <https://www.sparkfun.com/search/results?term=Screw+Terminals> (5mm/3.5mm/2.54mm spacing) This device is also useful as a general connection point to wire up your design to another part of your project. Our various solder wires solder well into these plated through hole pads. Hook-Up Wire - Assortment (Stranded, 22 AWG) <https://www.sparkfun.com/products/11375> (PRT-11375) Hook-Up Wire - Assortment (Solid Core, 22 AWG) <https://www.sparkfun.com/products/11367> (PRT-11367) View the entire wire category on our website here <https://www.sparkfun.com/categories/141> Special notes: Molex polarized connector foot print use with SKU : PRT-08231 with associated crimp pins and housings. 1MM SMD Version SKU: PRT-10208; PROD_ID: CONN-09696
J$1-J$15 = cubesat:WIREPOST
Q1 Q2 = cubesat_:BSS138: Digikey BSS138CT-ND; MANUFACTURER_PART_NUMBER: BSS138TA; VENDOR: Diodes Inc
Q3 Q4 = cubesat_:OSILLATOR: Digikey 535-9948-1-ND
R1-R7 R10 R14-R16 = cubesat_:RES_10K: Digikey 311-10KGRCT-ND
R8 R9 = cubesat_:RES_1M: Digikey 311-1.00MHRCT-ND
R11-R13 = cubesat_:RES_1K: Digikey YAG1237CT-ND
R17 = cubesat_:RES_4_7K: Digikey 311-4.7KGRCT-ND
SJ1 = jumper:SJ: SMD solder JUMPER
SJ2 SJ3 = microbuilder:SOLDERJUMPER: SMD Solder JUMPER Solder the two pads together to create a connection, or remove the solder to break it. REFLOW - Use this footprint for solder paste and reflow ovens. WAVE - Use this footprint for hand-soldering (larger pads). CLOSED - Has a trace between the two pads to ensure it is closed by default. The trace needs to be cut to disable the jumper, and can be closed again by creating a solder bridge between the two pads.
U1 = cubesat_:MIC5225: Digikey 576-2980-2-ND
U2 = ADM3488ARZ:ADM3488ARZ; MANUFACTURER_PART_NUMBER: ADM3488ARZ; VENDOR: Analog Devices Inc
U3 = cubesat_:ATMEGA16U2-MU; MANUFACTURER_PART_NUMBER: ATMEGA16U2MU; VENDOR: ATMEL
U4 = cubesat_:CD74HC4067SM96: Digikey 296-9226-1-ND; MANUFACTURER_PART_NUMBER: CD74HC4067SM96; VENDOR: Texas Instruments
U5 = cubesat_:TCA9548APWR: Digikey 296-34905-1-ND; MANUFACTURER_PART_NUMBER: TCA9548APWR; VENDOR: TEXAS INSTRUMENTS
U6-U8 = cubesat_:DS18B20U+T&R: Programmable Resolution 1-Wire Digital Thermometer; AVAILABILITY: Good; DESCRIPTION: Temp Sensor Digital Serial (1-Wire) 8-Pin uMAX T/R; MF: Maxim Integrated; MP: DS18B20U+T&amp;R; PACKAGE: MSOP-8 Maxim Integrated; PRICE: 2.79 USD

## Net classes
0 default: width 0.203 mm, drill 0.406 mm, clearance 0.203 mm
1 power: width 0.254 mm
2 gnd: width 0.305 mm, drill 0.406 mm, clearance 0.203 mm
3 power usb: width 0.508 mm, drill 0.406 mm, clearance 0.203 mm